# Altium schematic sheet Modbus RTU.SchDoc
size A; SheetNumber: 2; SheetTotal: 5
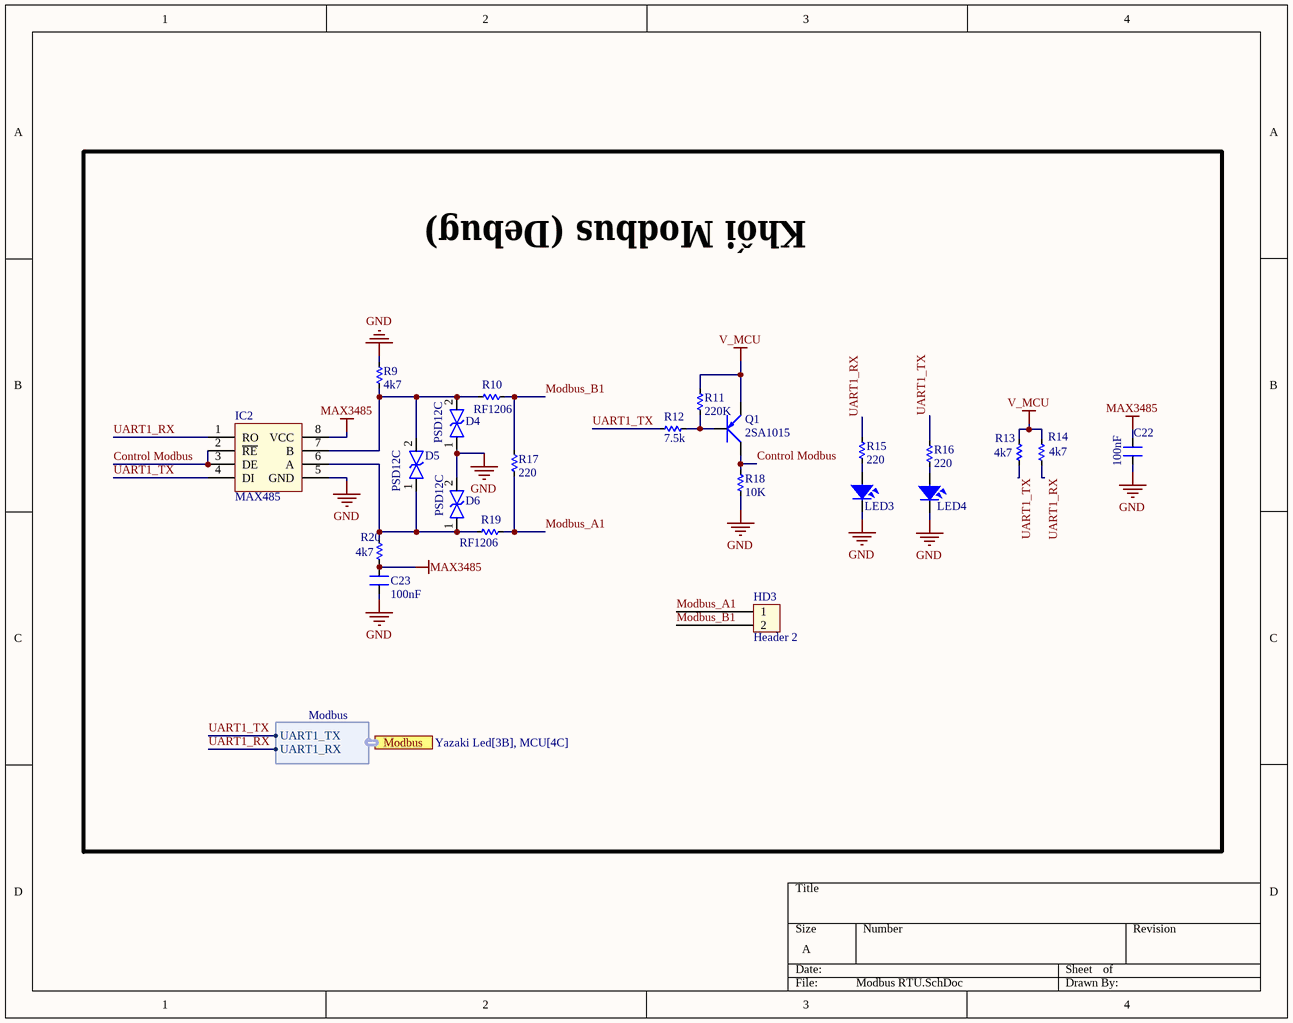
[diagram p0: Modbus RTU.SchDoc]

## Parts
C22  100nF  [CN-SMD-0603]
C23  100nF  [CN-SMD-0603]
D4  PSD12C  [PSD12C]
D5  PSD12C  [PSD12C]
D6  PSD12C  [PSD12C]
HD3  Header 2  [Header_2]
IC2  MAX485  [SO8]
LED3  LED  [LED-0805-Blue]  (value not drawn)
LED4  LED  [LED-0805-Blue]  (value not drawn)
Q1  2SA1015  [SOT23-321]
R9  4k7  [RES-SMD-0603]
R10  RF1206  [RES-SMD-1206]
R11  220K  [RES-SMD-0603]
R12  7.5k  [RES-SMD-0603]
R13  4k7  [RES-SMD-0603]
R14  4k7  [RES-SMD-0603]
R15  220  [RES-SMD-0603]
R16  220  [RES-SMD-0603]
R17  220  [RES-SMD-0603]
R18  10K  [RES-SMD-0603]
R19  RF1206  [RES-SMD-1206]
R20  4k7  [RES-SMD-0603]

## Ports
Modbus (harness Modbus, see Yazaki Led[3B], MCU[4C])

## Harnesses
Modbus: UART1_TX, UART1_RX

## Nets
GND: C22.1 C23.2 D4.1 D6.2 IC2.5(GND) LED3.2 LED4.2 R9.1 R18.1
MAX3485: C22.2 C23.1 IC2.8(VCC) R20.1
V_MCU: Q1.1(E) R11.2 R13.1 R14.1
Control Modbus: IC2.2(~{RE}) IC2.3(DE) Q1.2(C) R18.2
Modbus_A1: HD3.1 R17.2 R19.1
Modbus_B1: HD3.2 R10.1 R17.1
UART1_RX: IC2.1(RO) R14.2 R15.1 ; port Modbus.UART1_RX
UART1_TX: IC2.4(DI) R12.1 R13.2 R16.1 ; port Modbus.UART1_TX
NetD4_2: D4.2 D5.2 IC2.7(B) R9.2 R10.2
NetD5_1: D5.1 D6.1 IC2.6(A) R19.2 R20.2
NetLED3_1: LED3.1 R15.2
NetLED4_1: LED4.1 R16.2
NetQ1_3: Q1.3(B) R11.1 R12.2

## Notes on the sheet
- Khối Modbus (Debug)

## Library data of the parts
C22 C23 = CN: Value: 33pF
D4-D6 = PSD12C: diode tvs
HD3 = Header2: Value: Header 2
IC2 = MAX485: RS232 - RS485 (Same sn75176)
LED3 LED4 = LED SMD: Value: LED 3 - 5 ly 2 Colour
Q1 = 2SA1015: PNP 600mW, ECB; Value: A1015
R9-R20 = Res-SMD: Resistor; Manufacturer: Generic Components; Class: Passive; Published: 08/06/2000; Publisher: Altium Hobart Technology Centre